# Altium schematic sheet IR_TEMP_SENSE.SchDoc: IR_TEMP_SENSE
size 420 x 297 mm; Engineer: ALPER KORKMAZ; SheetNumber: 7; SheetTotal: 8; SHEET: 7
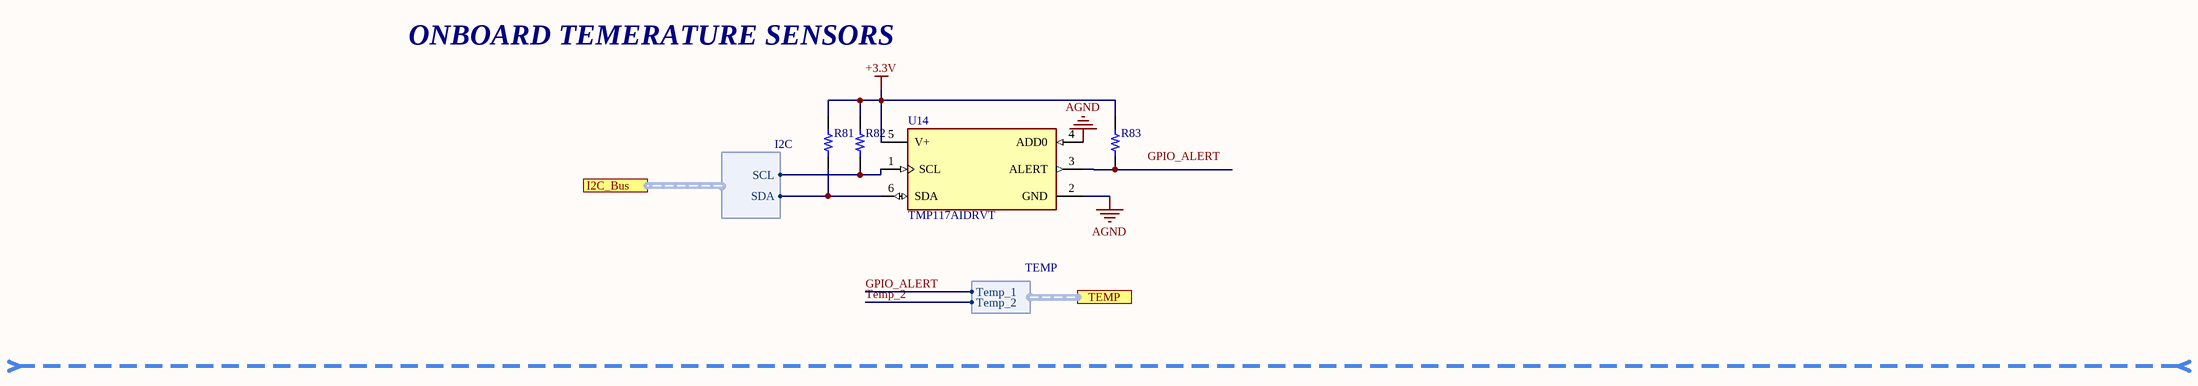
[diagram p0: IR_TEMP_SENSE.SchDoc]

## Parts
R81  (no value)  [RES 0603_1608]
R82  4.99 kOhms  [RES 0603_1608]  (value not drawn)
R83  4.99 kOhms  [RES 0603_1608]  (value not drawn)
U14  TMP117AIDRVT  [FP-DRV0006B-MFG]

## Ports
I2C_Bus (harness I2C, see 1[1C], 3[5B]), TEMP (harness TEMP, see 1[1C], 3[2B])

## Harnesses
I2C: SCL, SDA
TEMP: Temp_1, Temp_2

## Nets
+3.3V: R81.2 R82.2 R83.2 U14.5(V+)
AGND: U14.2(GND) U14.4(ADD0)
GPIO_ALERT: port TEMP.Temp_1
Temp_2: port TEMP.Temp_2
NetR81_1: R81.1 U14.6(SDA) ; port I2C_Bus.SDA
NetR82_1: R82.1 U14.1(SCL) ; port I2C_Bus.SCL
NetR83_1: R83.1 U14.3(ALERT)

## Notes on the sheet
- ONBOARD TEMERATURE SENSORS
- Labels drawn without touching a wire or pin: GPIO_ALERT
- THIS DOCUMENT AND THE DATA DISCLOSED HEREIN OR
- HEREWITH IS THE PROPERTY OF IRRESISTIBLE FUTURE AND MAY
- DWG NO:
- REVISION
- REV:
- DESCRIPTION
- DATE
- APPROVED
- BE FREELY DISTRIBUTED IN WHOLE. NO RIGHTS ARE
- RESERVED OR EXPRESS OR IMPLIED WARANTEE GIVEN.
- PROJECT
- Drawn by
- TITLE
- SCALE:
- A3
- SIZE
- Checked by
- FILE NAME
- SHEET
- OF
- 1:1
- 10

## Library data of the parts
R81 = RNCS0603BKE4K99: RES 4.99K OHM 0.1% 1/16W 0603; Manufacturer: Stackpole Electronics Inc; Power (Watts): 0.063W, 1/16W; Resistance: 4.99 kOhms; Temperature Coefficient: ±25ppm/°C; Part Number: RNCS0603BKE4K99; ComponentLink1Description: Datasheet; ComponentLink1URL: https://www.seielect.com/catalog/sei-rncs_rnch.pdf; ComponentLink2Description: DigiKey Link; ComponentLink2URL: https://www.digikey.com/en/products/detail/stackpole-electronics-inc/RNCS0603BKE4K99/1800030; Composition: Thin Film; Device Package: 0603 (1608 Metric); Features: Anti-Corrosive, Automotive AEC-Q200, Moisture Resistant; Height - Seated (Max): 0.022" (0.55mm); LastUpdated: 30.06.2022 22:25:20; Lifecycle Status: Active; Minimum Order: 1; Number of Terminations: 2; Operating Temperature: -55°C ~ 155°C; Package / Case: 0603 (1608 Metric); Packaging: TapeAndReel; PartId: 4844; Part Status: Active; Price: 0.08; Ratings: AEC-Q200; Series: RNCS; Size / Dimension: 0.061" L x 0.031" W (1.55mm x 0.80mm); Supplier 1: DigiKey; Supplier Part Number 1: RNCS0603BKE4K99CT-ND; Supplier Device Package: 0603; Tolerance: ±0.1%
R82 R83 = RNCS0603BKE4K99: RES 4.99K OHM 0.1% 1/16W 0603; Manufacturer: Stackpole Electronics Inc; Power (Watts): 0.063W, 1/16W; Temperature Coefficient: ±25ppm/°C; Part Number: RNCS0603BKE4K99; Value: 4.99 kOhms; ComponentLink1Description: Datasheet; ComponentLink1URL: https://www.seielect.com/catalog/sei-rncs_rnch.pdf; ComponentLink2Description: DigiKey Link; ComponentLink2URL: https://www.digikey.com/en/products/detail/stackpole-electronics-inc/RNCS0603BKE4K99/1800030; Composition: Thin Film; Device Package: 0603 (1608 Metric); Features: Anti-Corrosive, Automotive AEC-Q200, Moisture Resistant; Height - Seated (Max): 0.022" (0.55mm); LastUpdated: 30.06.2022 22:25:20; Lifecycle Status: Active; Minimum Order: 1; Number of Terminations: 2; Operating Temperature: -55°C ~ 155°C; Package / Case: 0603 (1608 Metric); Packaging: TapeAndReel; PartId: 4844; Part Status: Active; Price: 0.08; Ratings: AEC-Q200; Resistance: 4.99 kOhms; Series: RNCS; Size / Dimension: 0.061" L x 0.031" W (1.55mm x 0.80mm); Supplier 1: DigiKey; Supplier Part Number 1: RNCS0603BKE4K99CT-ND; Supplier Device Package: 0603; Tolerance: ±0.1%
U14 = CMP-04948-000053-1: SENSOR TEMP; Resolution: 16b; Output Type: I2C; Packaging: Tape and Reel; Min Operating Temperature: -55°C; RoHS Compliant: Yes; Mount: Surface Mount; Max Operating Temperature: 150°C